# EAGLE schematic l-drv (EAGLE 6.5.0)
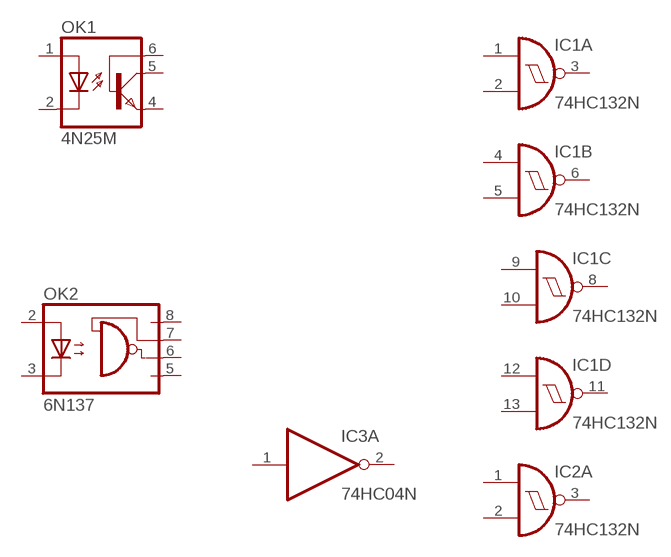
[diagram p0: schematic, sheet 1]

## Parts
IC1  74HC132N  [DIL14]
IC2  74HC132N  [DIL14]
IC3  74HC04N  [DIL14]
OK1  4N25M  [DIL06]
OK2  6N137  [DIL08]
Unconnected: IC1.1(A:I0) IC1.2(A:I1) IC1.3(A:O) IC1.4(B:I0) IC1.5(B:I1) IC1.6(B:O) IC1.8(C:O) IC1.9(C:I0) IC1.10(C:I1) IC1.11(D:O) IC1.12(D:I0) IC1.13(D:I1) IC2.1(A:I0) IC2.2(A:I1) IC2.3(A:O) IC2.4(B:I0) IC2.5(B:I1) IC2.6(B:O) IC2.8(C:O) IC2.9(C:I0) IC2.10(C:I1) IC2.11(D:O) IC2.12(D:I0) IC2.13(D:I1) IC3.1(A:I) IC3.2(A:O) IC3.3(B:I) IC3.4(B:O) IC3.5(C:I) IC3.6(C:O) IC3.8(D:O) IC3.9(D:I) IC3.10(E:O) IC3.11(E:I) IC3.12(F:O) IC3.13(F:I) OK1.1(A) OK1.2(C) OK1.4(EMI) OK1.5(COL) OK1.6(BAS) OK2.2(A) OK2.3(C) OK2.5(GND) OK2.6(VO) OK2.7(VE) OK2.8(VCC)

## Power pins joined to a net without a drawn wire
GND: IC1.7(P:GND) IC2.7(P:GND) IC3.7(P:GND)
VCC: IC1.14(P:VCC) IC2.14(P:VCC) IC3.14(P:VCC)

## Library data of the parts
IC1 IC2 = 74xx-eu:74*132: Quad 2-input NAND schmitt trigger
IC3 = 74xx-eu:74*04: Hex INVERTER
OK1 = optocoupler:4N*?M: General Purpose 6-Pin Phototransistor Optocouplers Source: http://www.fairchildsemi.com/ds/4N/4N35-M.pdf; MPN: 4N25-M; OC_FARNELL: 1021349; OC_NEWARK: 98K9084
OK2 = optocoupler:6N137: MOTOROLA OPTO COUPLER; MPN: 6N137; OC_FARNELL: 1328376; OC_NEWARK: 52M1895